# EAGLE design joystick (EAGLE 8.1.0)
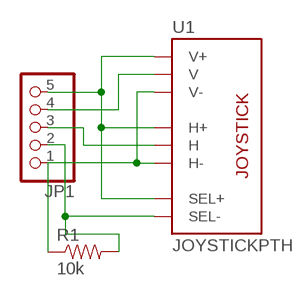
[diagram p0: schematic, sheet 1]

## Parts
JP1  PINHD-1X5  [1X05]
R1  10k  RESISTOR0805-RES  [0805]
U1  JOYSTICKPTH  [JOYSTICK]

## Nets
BTN: JP1.2 R1.2 U1.B2A(SEL-)
GND: JP1.1 R1.1 U1.H3(H-) U1.V3(V-)
VCC: JP1.5 U1.B1A(SEL+) U1.H1(H+) U1.V1(V+)
X: JP1.4 U1.V2(V)
Y: JP1.3 U1.H2(H)

## Library data of the parts
JP1 = pinhead:PINHD-1X5: PIN HEADER
R1 = SparkFun-Passives:RESISTOR: Resistor Basic schematic elements and footprints for 0603, 1206, and PTH resistors.
U1 = adafruit:JOYSTICK: Thumb Joystick Joystick commonly found in PS2 controllers. Two pots and a select switch. Adapted from Sparkfun Library (but for more common 6mm switch sticks)

## Board
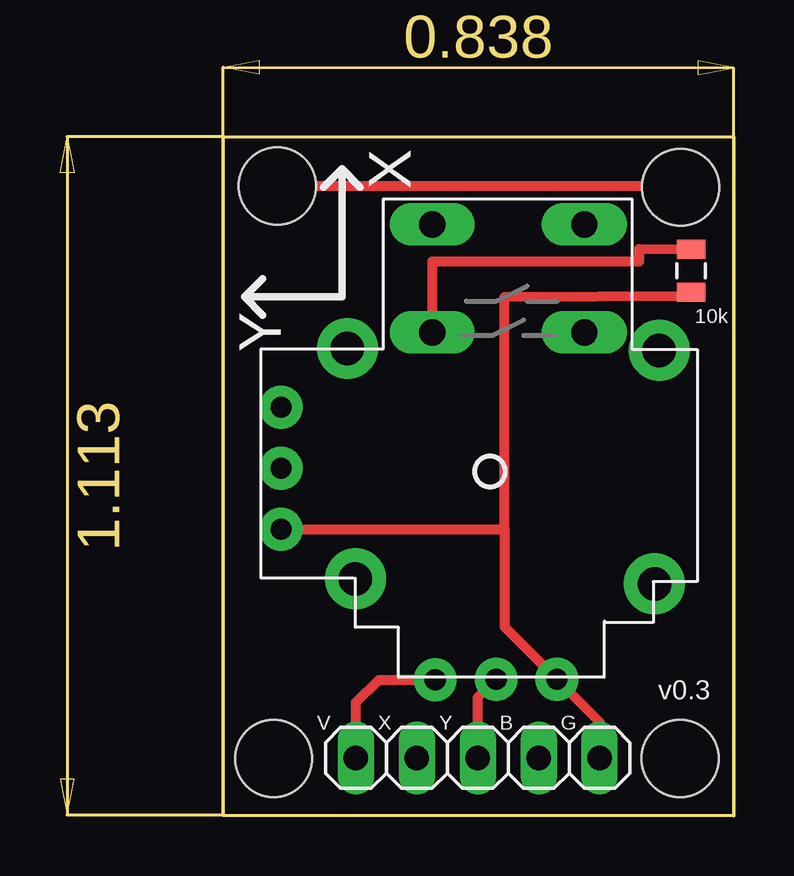
[diagram p1: board, top side]
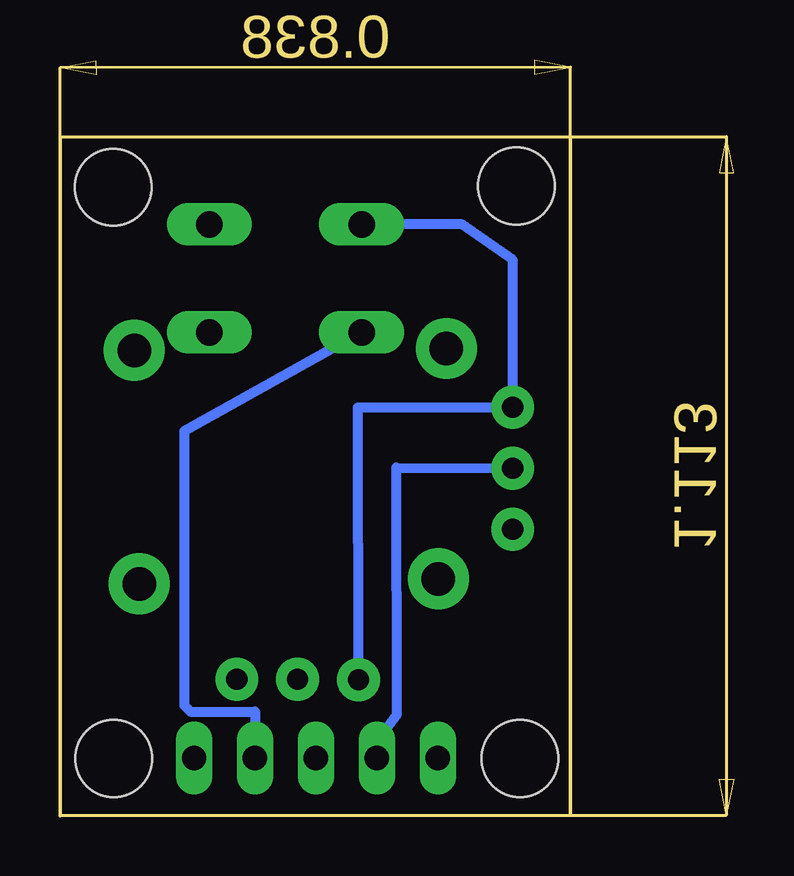
[diagram p2: board, bottom side, seen from below]

Size 21.29 x 28.3 mm. Coordinates in mm from the lower left corner, seen from the top.
Outline: 21.29,0 21.29,28.27 0,28.3 0,0.02 21.29,0
Copper layers (1*16): Top 0.0356mm / dielectric 1.5011mm / Bottom 0.0356mm
Design rules "oshpark-2layer": minimum track width 6mil, minimum drill 13mil, track to track 6mil, track to pad 6mil, pad to pad 6mil, via to via 6mil, smd to smd 6mil, copper to edge 15mil, drill to drill 6mil, minimum pad ring 7mil, minimum via ring 7mil, stop-mask expansion 2.5mil, vias tented up to drill 0mil, thermal gap 10mil
Holes 3.2 mm at 2.11,2.39 2.26,26.24 19.08,26.19 19.05,2.39

### Footprints (pad centres in the part's own frame; a part is rotated, then mirrored left to right if it is on the bottom)
1X05 = drill 1.016 long: 1 -5.08,0; 2 -2.54,0; 3 0,0; 4 2.54,0; 5 5.08,0
0805 = smd 0.8 x 1.2: 1 -0.9,0; 2 0.9,0
JOYSTICK = drill 1.1 pad 1.778 long: B1A -2.413,10.291; B1B 3.937,10.291; B2A -2.413,5.791; B2B 3.937,5.791 | drill 0.889 pad 1.778: H1 -2.286,-8.687; H2 0.254,-8.661; H3 2.794,-8.661; V1 -8.712,2.667; V2 -8.712,0.127; V3 -8.712,-2.413 | drill 1.397 pad 2.54: MOUNT1 -5.944,5.118; MOUNT2 -5.613,-4.483; MOUNT3 6.858,-4.686; MOUNT4 7.061,5.042

### Placement (x,y rotation side)
JP1  10.62,2.41 180 top
R1  19.51,22.71 90 top
U1  11.13,14.35 0 top

### Tracks (layer width: path | path; a pad name or v marks a point on that pad's centre or on a via)
BTN
  Top 0.406: R1.2 17.33,23.62 17.33,23.09 8.71,23.09 U1.B2A
  Bottom 0.406: U1.B2A 16.1,16.03 16.1,4.6 15.85,4.34 13.16,4.34 JP1.2
GND
  Top 0.406: JP1.1 15.7,3.91 U1.H3 11.74,7.87 11.74,11.94 | 11.74,11.94 11.74,21.62 19.48,21.67 R1.1 | U1.V3 11.74,11.94
N$1
  Top 0.406: 19.08,26.24 2.21,26.24
VCC
  Top 0.406: JP1.5 5.54,4.72 6.5,5.66 U1.H1
  Bottom 0.406: U1.H1 8.87,17.02 U1.V1 2.41,23.16 4.52,24.64 U1.B1A
X
  Bottom 0.406: JP1.4 7.72,3.58 7.24,4.22 7.27,14.5 U1.V2
Y
  Top 0.406: JP1.3 10.62,4.93 U1.H2

### Text on the board
tPlace: X | 10k | Y | v0.3 | V | X | Y | B | G